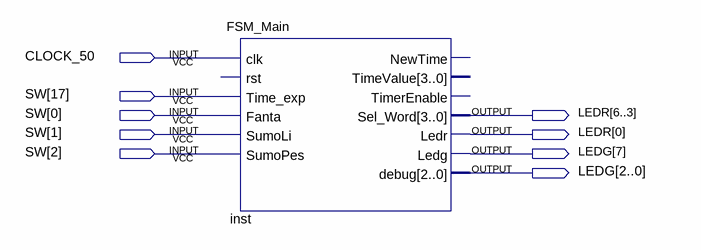
[diagram p0: schematic sheet]
// Quartus schematic FSM_Block.bdf as structural Verilog: 1 symbols, 9 pins
module FSM_Block (
  input  CLOCK_50,
  input  [17:0] SW,
  output [6:0] LEDR,
  output [7:0] LEDG
);

  FSM_Main inst (
    .clk(CLOCK_50), .Time_exp(SW[17]), .Fanta(SW[0]), .SumoLi(SW[1]), .SumoPes(SW[2]), .Sel_Word(LEDR[6:3]),
    .Ledr(LEDR[0]), .Ledg(LEDG[7]), .debug(LEDG[2:0]));  // open: rst, NewTime, TimeValue, TimerEnable
endmodule
